# Altium schematic sheet displays.SchDoc
size A
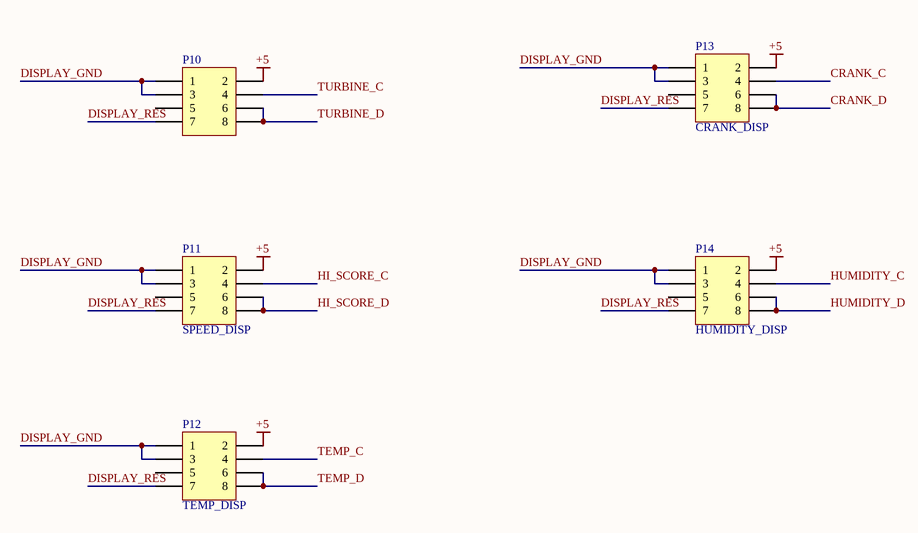
[diagram p0: displays.SchDoc]

## Parts
P10  (no value)  [HDR2X4]
P11  SPEED_DISP  [HDR2X4]
P12  TEMP_DISP  [HDR2X4]
P13  CRANK_DISP  [HDR2X4]
P14  HUMIDITY_DISP  [HDR2X4]

## Nets
+5: P10.2 P11.2 P12.2 P13.2 P14.2
CRANK_C: P13.4
CRANK_D: P13.6 P13.8
DISPLAY_GND: P10.1 P10.3 P11.1 P11.3 P12.1 P12.3 P13.1 P13.3 P14.1 P14.3
DISPLAY_RES: P10.7 P11.7 P12.7 P13.7 P14.7
HI_SCORE_C: P11.4
HI_SCORE_D: P11.6 P11.8
HUMIDITY_C: P14.4
HUMIDITY_D: P14.6 P14.8
TEMP_C: P12.4
TEMP_D: P12.6 P12.8
TURBINE_C: P10.4
TURBINE_D: P10.6 P10.8

Not connected (* = marked no-connect by the designer): P10 5; P11 5; P12 5; P13 5; P14 5

## Library data of the parts
P10-P14 = Header 4X2: Header, 4-Pin, Dual row; LatestRevisionDate: 17-Jul-2002; LatestRevisionNote: Re-released for DXP Platform.; Publisher: Altium Limited